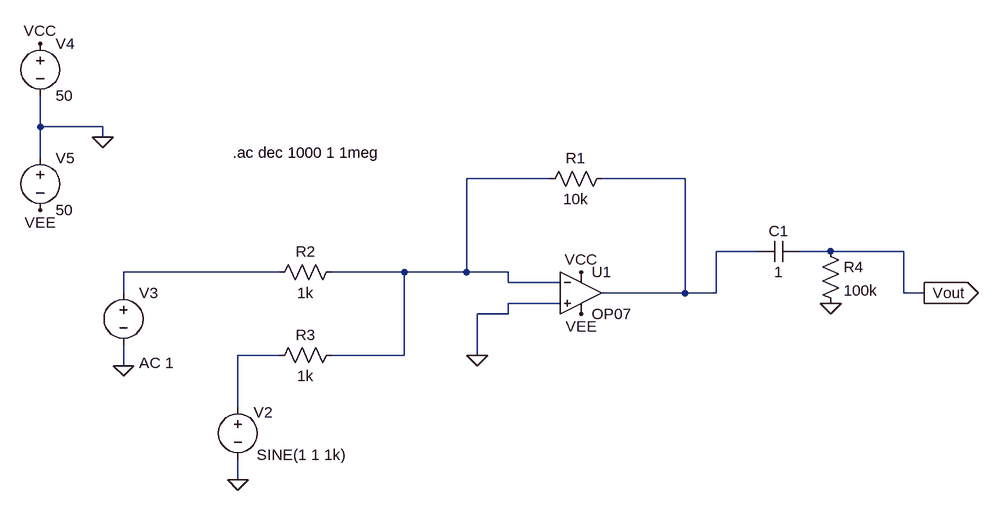
[diagram p0: schematic IdealOPamp_adder_input_impedance.asc]
IdealOPamp_adder_input_impedance.asc, the LTspice schematic file:
Version 4
SHEET 1 1040 680
WIRE -432 -32 -432 -80
WIRE -336 -32 -432 -32
WIRE -336 -16 -336 -32
WIRE -432 16 -432 -32
WIRE 352 48 224 48
WIRE 560 48 432 48
WIRE 672 160 608 160
WIRE 784 160 736 160
WIRE 896 160 784 160
WIRE -64 192 -304 192
WIRE 128 192 16 192
WIRE 224 192 224 48
WIRE 224 192 128 192
WIRE 288 192 224 192
WIRE 288 208 288 192
WIRE 368 208 288 208
WIRE -304 224 -304 192
WIRE 560 224 560 48
WIRE 560 224 432 224
WIRE 608 224 608 160
WIRE 608 224 560 224
WIRE 896 224 896 160
WIRE 928 224 896 224
WIRE 368 240 288 240
WIRE 288 256 288 240
WIRE 288 256 240 256
WIRE -64 320 -128 320
WIRE 128 320 128 192
WIRE 128 320 16 320
WIRE 240 320 240 256
WIRE -304 336 -304 304
WIRE -128 400 -128 320
WIRE -128 512 -128 480
FLAG 928 224 Vout
IOPIN 928 224 Out
FLAG -336 -16 0
FLAG -432 -160 VCC
FLAG 400 192 VCC
FLAG -432 96 VEE
FLAG 400 256 VEE
FLAG -304 336 0
FLAG -128 512 0
FLAG 240 320 0
FLAG 784 240 0
SYMBOL res 448 32 R90
WINDOW 0 0 56 VBottom 2
WINDOW 3 32 56 VTop 2
SYMATTR InstName R1
SYMATTR Value 10k
SYMBOL res 32 176 R90
WINDOW 0 0 56 VBottom 2
WINDOW 3 32 56 VTop 2
SYMATTR InstName R2
SYMATTR Value 1k
SYMBOL res 32 304 R90
WINDOW 0 0 56 VBottom 2
WINDOW 3 32 56 VTop 2
SYMATTR InstName R3
SYMATTR Value 1k
SYMBOL voltage -128 384 R0
WINDOW 0 24 24 Left 2
WINDOW 3 29 89 Left 2
WINDOW 123 0 0 Left 0
WINDOW 39 0 0 Left 0
SYMATTR InstName V2
SYMATTR Value SINE(1 1 1k)
SYMBOL voltage -304 208 R0
WINDOW 123 24 124 Left 2
WINDOW 39 0 0 Left 0
SYMATTR Value2 AC 1
SYMATTR InstName V3
SYMATTR Value ""
SYMBOL Opamps\\OP07 400 160 R0
SYMATTR InstName U1
SYMBOL voltage -432 -176 R0
WINDOW 123 0 0 Left 0
WINDOW 39 0 0 Left 0
SYMATTR InstName V4
SYMATTR Value 50
SYMBOL voltage -432 0 R0
WINDOW 123 0 0 Left 0
WINDOW 39 0 0 Left 0
SYMATTR InstName V5
SYMATTR Value 50
SYMBOL cap 736 144 R90
WINDOW 0 0 32 VBottom 2
WINDOW 3 32 32 VTop 2
SYMATTR InstName C1
SYMATTR Value 1
SYMBOL res 768 144 R0
SYMATTR InstName R4
SYMATTR Value 100k
TEXT -136 8 Left 2 !.ac dec 1000 1 1meg

The netlist it stands for:
* IdealOPamp_adder_input_impedance.asc
R1 N002 N001 10k
R2 N001 N003 1k
R3 N001 N004 1k
V2 N004 0 SINE(1 1 1k)
V3 N003 0 AC 1
XU1 0 N001 VCC VEE N002 LT1001  ; OP07, pins In+ In- V+ V- OUT
V4 VCC 0 50
V5 0 VEE 50
C1 Vout N002 1
R4 Vout 0 100k
.ac dec 1000 1 1meg
.lib LTC.lib
.backanno
.end